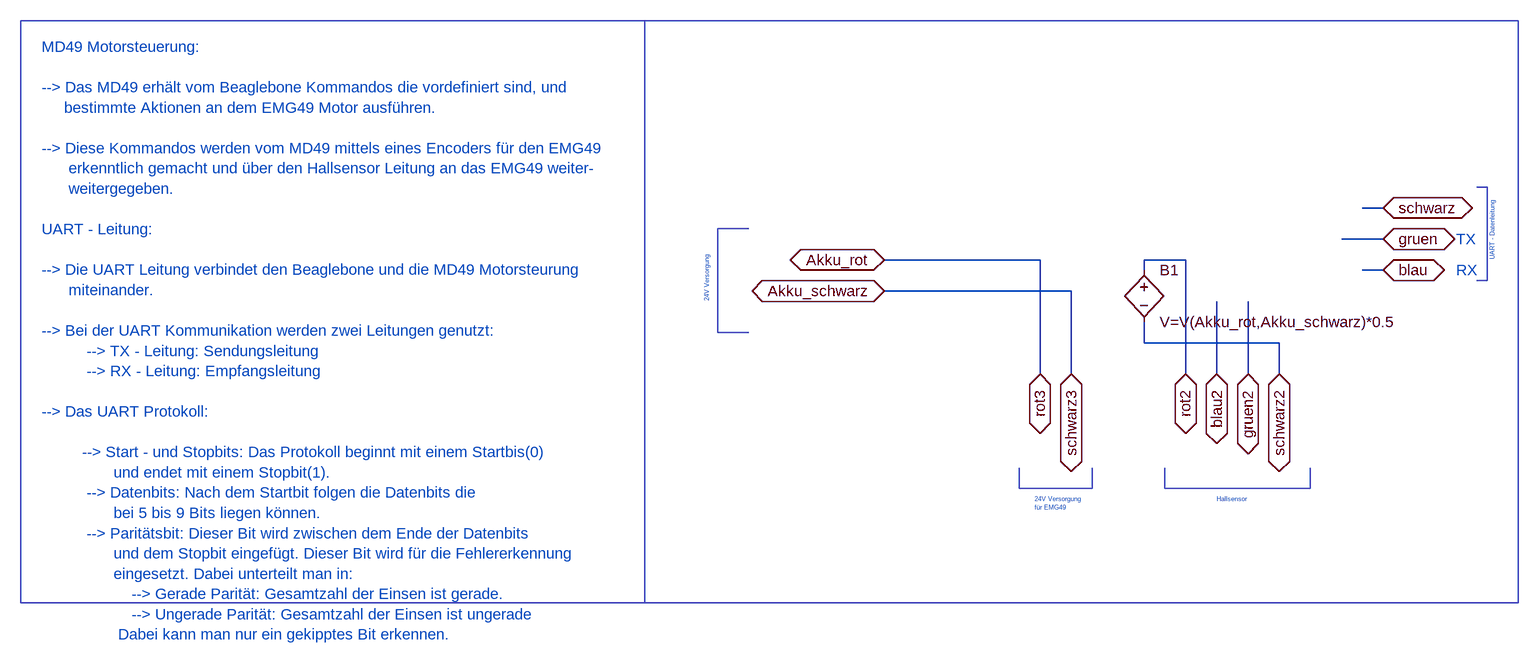
[diagram p0: schematic EMG49Controller.asc]
EMG49Controller.asc, the LTspice schematic file:
Version 4
SHEET 1 1044 680
WIRE 832 -48 800 -48
WIRE 832 0 768 0
WIRE 304 32 64 32
WIRE 528 32 464 32
WIRE 464 48 464 32
WIRE 832 48 800 48
WIRE 352 80 64 80
WIRE 464 160 464 128
WIRE 672 160 464 160
WIRE 304 208 304 32
WIRE 352 208 352 80
WIRE 528 208 528 32
WIRE 576 208 576 96
WIRE 624 208 624 96
WIRE 672 208 672 160
FLAG 64 80 Akku_schwarz
IOPIN 64 80 BiDir
FLAG 64 32 Akku_rot
IOPIN 64 32 BiDir
FLAG 832 -48 schwarz
IOPIN 832 -48 BiDir
FLAG 832 0 gruen
IOPIN 832 0 BiDir
FLAG 832 48 blau
IOPIN 832 48 BiDir
FLAG 672 208 schwarz2
IOPIN 672 208 BiDir
FLAG 624 208 gruen2
IOPIN 624 208 BiDir
FLAG 576 208 blau2
IOPIN 576 208 BiDir
FLAG 528 208 rot2
IOPIN 528 208 BiDir
FLAG 352 208 schwarz3
IOPIN 352 208 BiDir
FLAG 304 208 rot3
IOPIN 304 208 BiDir
SYMBOL bv 464 32 R0
SYMATTR InstName B1
SYMATTR Value V=V(Akku_rot,Akku_schwarz)*0.5
TEXT -1232 -296 Left 2 ;MD49 Motorsteuerung:\n \n--> Das MD49 erhält vom Beaglebone Kommandos die vordefiniert sind, und \n     bestimmte Aktionen an dem EMG49 Motor ausführen.\n \n--> Diese Kommandos werden vom MD49 mittels eines Encoders für den EMG49\n      erkenntlich gemacht und über den Hallsensor Leitung an das EMG49 weiter-\n      weitergegeben.\n \nUART - Leitung:\n \n--> Die UART Leitung verbindet den Beaglebone und die MD49 Motorsteurung\n      miteinander.\n \n--> Bei der UART Kommunikation werden zwei Leitungen genutzt:\n          --> TX - Leitung: Sendungsleitung \n          --> RX - Leitung: Empfangsleitung\n \n--> Das UART Protokoll:\n          \n         --> Start - und Stopbits: Das Protokoll beginnt mit einem Startbis(0) \n                und endet mit einem Stopbit(1).\n          --> Datenbits: Nach dem Startbit folgen die Datenbits die \n                bei 5 bis 9 Bits liegen können.\n          --> Paritätsbit: Dieser Bit wird zwischen dem Ende der Datenbits\n                und dem Stopbit eingefügt. Dieser Bit wird für die Fehlererkennung\n                eingesetzt. Dabei unterteilt man in: \n                    --> Gerade Parität: Gesamtzahl der Einsen ist gerade.\n                    --> Ungerade Parität: Gesamtzahl der Einsen ist ungerade\n                 Dabei kann man nur ein gekipptes Bit erkennen.
TEXT -208 96 VLeft 0 ;24V Versorgung
TEXT 296 400 Left 0 ;24V Versorgung \nfür EMG49
TEXT 576 400 Left 0 ;Hallsensor
TEXT 1000 32 VLeft 0 ;UART - Datenleitung
TEXT 944 0 Left 2 ;TX
TEXT 944 48 Left 2 ;RX
LINE Normal -192 -16 -144 -16
LINE Normal -192 144 -192 -16
LINE Normal -144 144 -192 144
LINE Normal 272 384 272 352
LINE Normal 384 384 272 384
LINE Normal 384 352 384 384
LINE Normal 496 384 496 352
LINE Normal 720 384 496 384
LINE Normal 720 352 720 384
LINE Normal 992 -80 976 -80
LINE Normal 992 64 992 -80
LINE Normal 976 64 992 64
RECTANGLE Normal -304 560 -1264 -336
RECTANGLE Normal 1040 560 -1264 -336

The netlist it stands for:
* EMG49Controller.asc
B1 rot2 schwarz2 V=V(Akku_rot,Akku_schwarz)*0.5
* MD49 Motorsteuerung:
* --> Das MD49 erhält vom Beaglebone Kommandos die vordefiniert sind, und
*      bestimmte Aktionen an dem EMG49 Motor ausführen.
* --> Diese Kommandos werden vom MD49 mittels eines Encoders für den EMG49
*       erkenntlich gemacht und über den Hallsensor Leitung an das EMG49 weiter-
*       weitergegeben.
* UART - Leitung:
* --> Die UART Leitung verbindet den Beaglebone und die MD49 Motorsteurung
*       miteinander.
* --> Bei der UART Kommunikation werden zwei Leitungen genutzt:
*           --> TX - Leitung: Sendungsleitung
*           --> RX - Leitung: Empfangsleitung
* --> Das UART Protokoll:
*          --> Start - und Stopbits: Das Protokoll beginnt mit einem Startbis(0)
*                 und endet mit einem Stopbit(1).
*           --> Datenbits: Nach dem Startbit folgen die Datenbits die
*                 bei 5 bis 9 Bits liegen können.
*           --> Paritätsbit: Dieser Bit wird zwischen dem Ende der Datenbits
*                 und dem Stopbit eingefügt. Dieser Bit wird für die Fehlererkennung
*                 eingesetzt. Dabei unterteilt man in:
*                     --> Gerade Parität: Gesamtzahl der Einsen ist gerade.
*                     --> Ungerade Parität: Gesamtzahl der Einsen ist ungerade
*                  Dabei kann man nur ein gekipptes Bit erkennen.
* 24V Versorgung
* 24V Versorgung
* für EMG49
* Hallsensor
* UART - Datenleitung
* TX
* RX
.backanno
.end